# EAGLE schematic gate_board v1 (EAGLE 9.7.0)
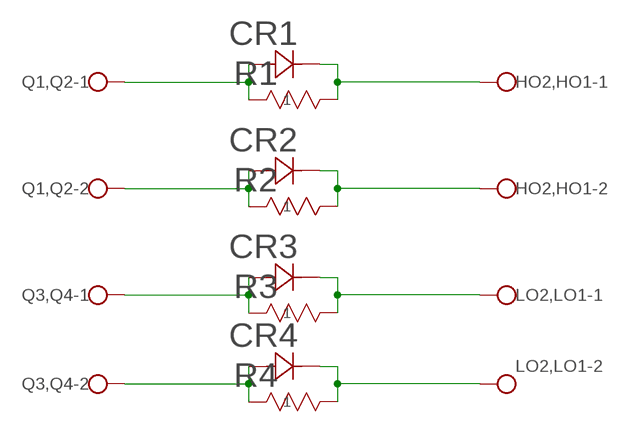
[diagram p0: schematic, sheet 1]

## Parts
CR1  1N4007CR_1N4005_ONS  [CR_1N4005_ONS]
CR2  1N4007CR_1N4005_ONS  [CR_1N4005_ONS]
CR3  1N4007CR_1N4005_ONS  [CR_1N4005_ONS]
CR4  1N4007CR_1N4005_ONS  [CR_1N4005_ONS]
HO2,HO1  W237-02P  [W237-132]
LO2,LO1  W237-02P  [W237-132]
Q1,Q2  W237-02P  [W237-132]
Q3,Q4  W237-02P  [W237-132]
R1  CF14JT10K0STA_CF14_STP  [STA_CF14_STP]
R2  CF14JT10K0STA_CF14_STP  [STA_CF14_STP]
R3  CF14JT10K0STA_CF14_STP  [STA_CF14_STP]
R4  CF14JT10K0STA_CF14_STP  [STA_CF14_STP]

## Nets
N$1: CR1.2 Q1,Q2.1 R1.1
N$2: CR1.1 HO2,HO1.1 R1.2
N$3: CR2.2 Q1,Q2.2 R2.1
N$4: CR2.1 HO2,HO1.2 R2.2
N$5: CR3.2 Q3,Q4.1 R3.1
N$6: CR3.1 LO2,LO1.1 R3.2
N$7: CR4.2 Q3,Q4.2 R4.1
N$8: CR4.1 LO2,LO1.2 R4.2

## Library data of the parts
CR1-CR4 = 2024-12-05_04-23-24_Library:1N4007; COPYRIGHT: Copyright (C) 2024 Ultra Librarian. All rights reserved.; MANUFACTURER_PART_NUMBER: 1N4007; MFR_NAME: onsemi
HO2,HO1 LO2,LO1 Q1,Q2 Q3,Q4 = con-wago-508:W237-02P: WAGO SREW CLAMP
R1-R4 = 2024-12-04_14-13-54_Library:CF14JT10K0; COPYRIGHT: Copyright (C) 2024 Ultra Librarian. All rights reserved.; MANUFACTURER_PART_NUMBER: CF14JT10K0; MFR_NAME: Stackpole International